# EAGLE design Sonar_Power_Schematic_LT1962_5_33 (EAGLE 8.4.0)
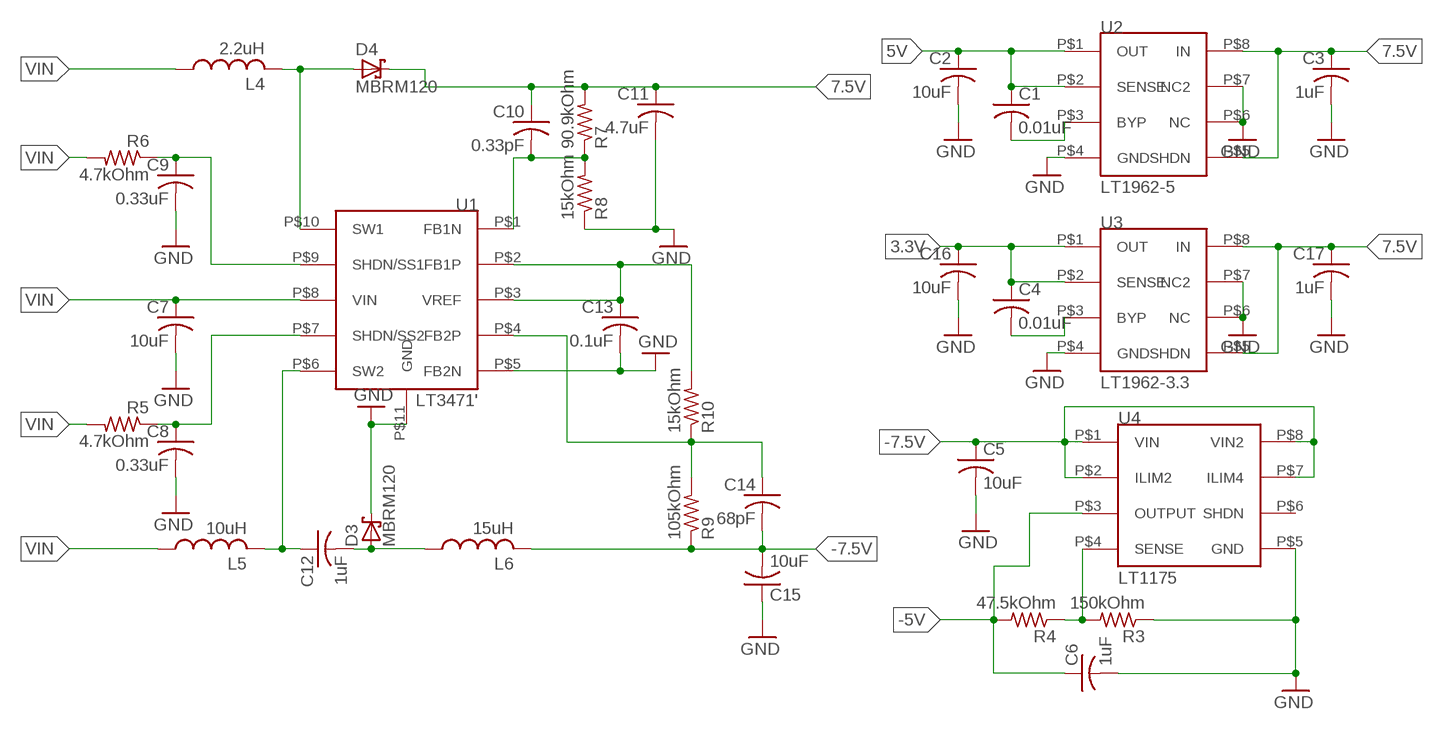
[diagram p0: schematic, sheet 1]

## Parts
C1  0.01uF  C-USC0603  [C0603]
C2  10uF  C-USC0603  [C0603]
C3  1uF  C-USC0603  [C0603]
C4  0.01uF  C-USC0603  [C0603]
C5  10uF  C-USC0603  [C0603]
C6  1uF  C-USC0603  [C0603]
C7  10uF  C-USC0603  [C0603]
C8  0.33uF  C-USC0603  [C0603]
C9  0.33uF  C-USC0603  [C0603]
C10  0.33pF  C-USC0603  [C0603]
C11  4.7uF  C-USC0603  [C0603]
C12  1uF  C-USC0603  [C0603]
C13  0.1uF  C-USC0603  [C0603]
C14  68pF  C-USC0603  [C0603]
C15  10uF  C-USC0603  [C0603]
C16  10uF  C-USC0603  [C0603]
C17  1uF  C-USC0603  [C0603]
D3  MBRM120  [DO-216AA]
D4  MBRM120  [DO-216AA]
L4  2.2uH  LQH5BPN2R2N38L  [NS4.9X4.9]
L5  10uH  VLS5045EX-100M2  [NS5X5]
L6  15uH  VLS5045EX-150M-CA1  [NS5X5]
R3  150kOhm  R-US_R0603  [R0603]
R4  47.5kOhm  R-US_R0603  [R0603]
R5  4.7kOhm  R-US_R0603  [R0603]
R6  4.7kOhm  R-US_R0603  [R0603]
R7  90.9kOhm  R-US_R0603  [R0603]
R8  15kOhm  R-US_R0603  [R0603]
R9  105kOhm  R-US_R0603  [R0603]
R10  15kOhm  R-US_R0603  [R0603]
U1  LT3471'  [10-WFDFN]
U2  LT1962-5  [8-MSOP]
U3  LT1962-3.3  [8-MSOP]
U4  LT1175  [8-SOIC]

## Nets
3.3V: C4.1 C16.1 U3.P$1(OUT) U3.P$2(SENSE)
5V: C1.1 C2.1 U2.P$1(OUT) U2.P$2(SENSE)
7.5V: C3.1 C10.1 C11.1 C17.1 D4.P$1(C) R7.2 U2.P$5(SHDN) U2.P$8(IN) U3.P$5(SHDN) U3.P$8(IN)
-5V: C6.1 R4.2 U4.P$3(OUTPUT)
-7.5V: C5.1 C14.2 C15.2 L6.P$2 R9.1 U4.P$1(VIN) U4.P$2(ILIM2) U4.P$7(ILIM4) U4.P$8(VIN2)
GND: C2.2 C3.2 C5.2 C6.2 C7.2 C8.2 C9.2 C11.2 C13.2 C15.1 C16.2 C17.2 D3.P$1(C) R3.1 R8.1 U1.P$5(FB2N) U1.P$11(GND) U2.P$4(GND) U2.P$6(NC) U2.P$7(NC2) U3.P$4(GND) U3.P$6(NC) U3.P$7(NC2) U4.P$5(GND)
N$1: C4.2 U3.P$3(BYP)
N$4: C1.2 U2.P$3(BYP)
N$9: R3.2 R4.1 U4.P$4(SENSE)
N$17: D4.P$2(A) L4.P$2 U1.P$10(SW1)
N$18: C10.2 R7.1 R8.2 U1.P$1(FB1N)
N$20: C12.1 L5.P$2 U1.P$6(SW2)
N$21: C12.2 D3.P$2(A) L6.P$1
N$26: C14.1 R9.2 R10.1 U1.P$4(FB2P)
SS1: C9.1 R6.1 U1.P$9(SHDN/SS1)
SS2: C8.1 R5.1 U1.P$7(SHDN/SS2)
VIN: C7.1 L4.P$1 L5.P$1 R5.2 R6.2 U1.P$8(VIN)
VREF: C13.1 R10.2 U1.P$2(FB1P) U1.P$3(VREF)
Unconnected: U4.P$6(SHDN)

## Library data of the parts
C1-C17 = adafruit:C-US: CAPACITOR, American symbol
D3 D4 = Moira:MBRM120
L4 = Moira:LQH5BPN2R2N38L: 2.2uH
L5 = Moira:VLS5045EX-100M: VLS5045EX-100M, TDK 10uH, 445-174843-1-ND
L6 = Moira:VLS5045EX-150M-CA: VLS5045EX-150M-CA, TDK 15uH, 445-175141-1-ND
R3-R10 = adafruit:R-US_: RESISTOR, American symbol
U1 = Moira:LT3471: LT3471EDD#TRPBF
U2 = Moira:LT1962-5
U3 = Moira:LT1962-3.3
U4 = Moira:LT1175: LT1175IS8#PBF

## Board
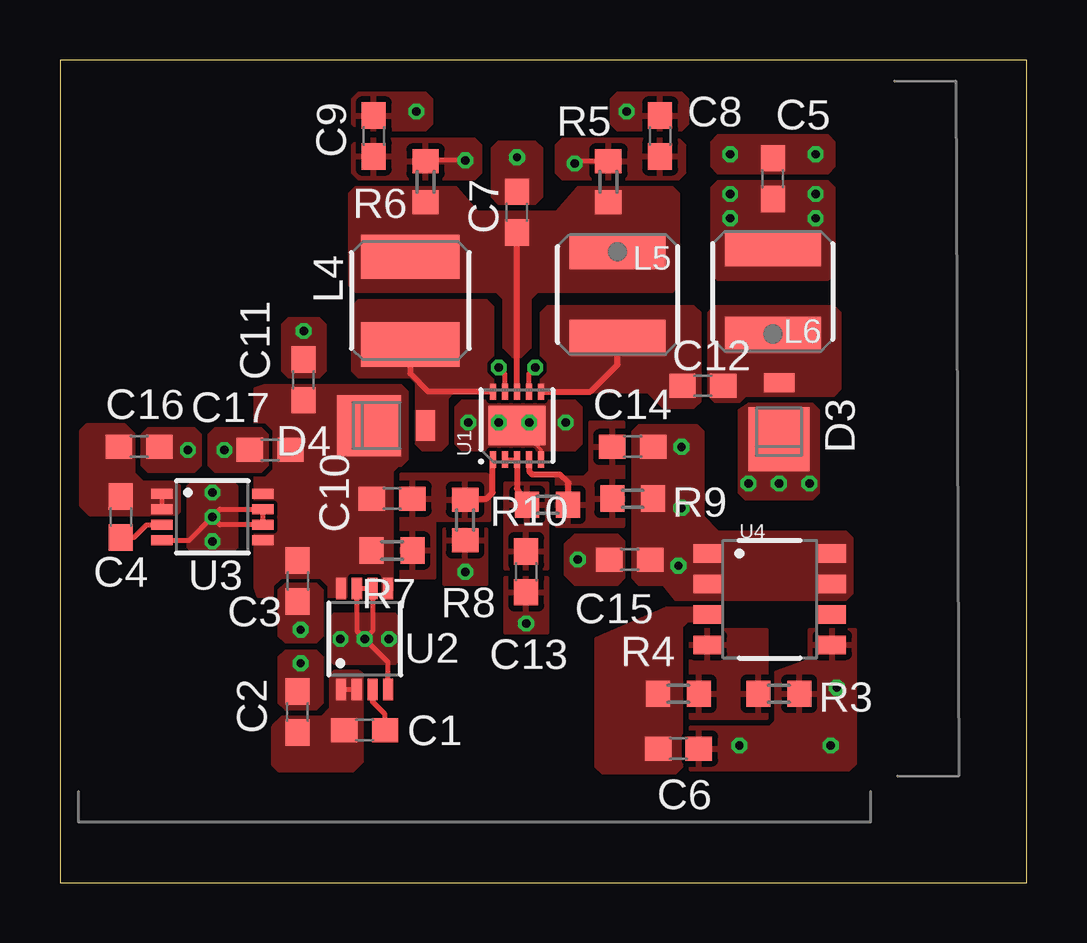
[diagram p1: board, top side]
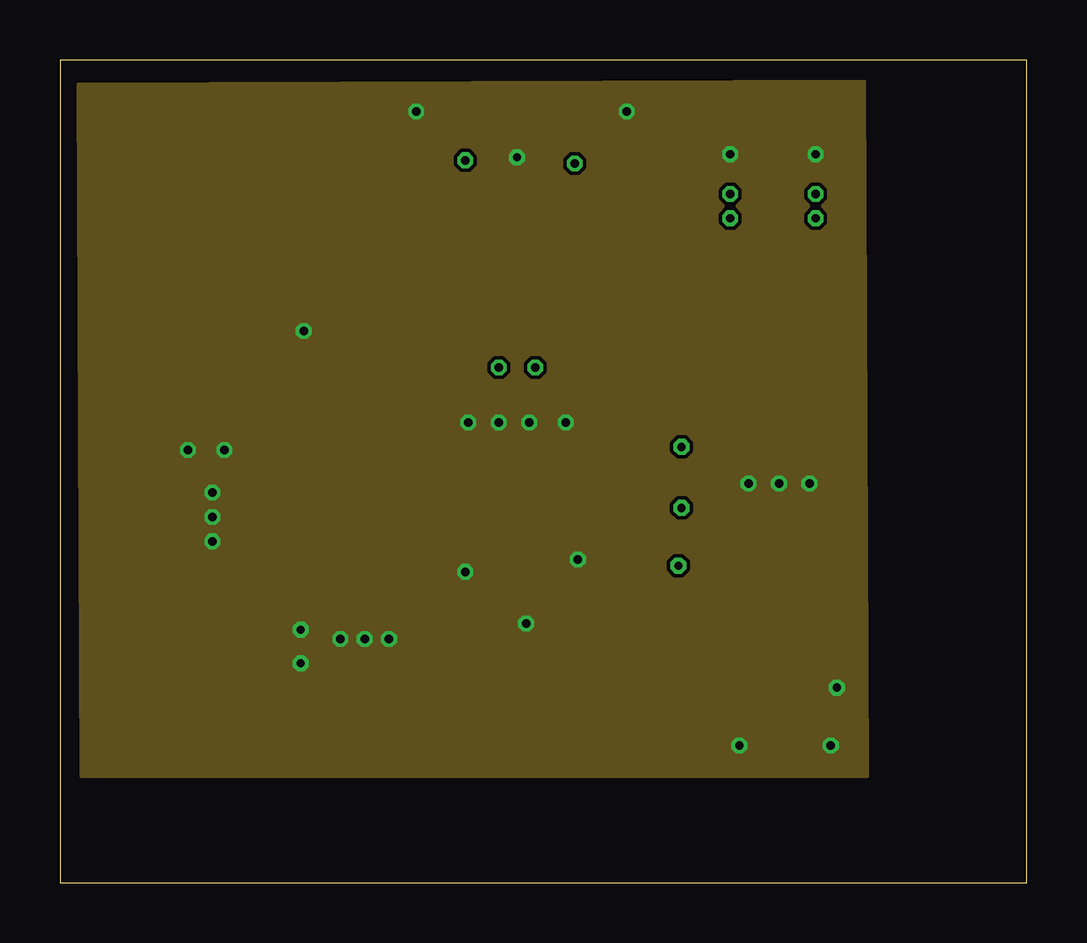
[diagram p2: board, inner layer Route2]
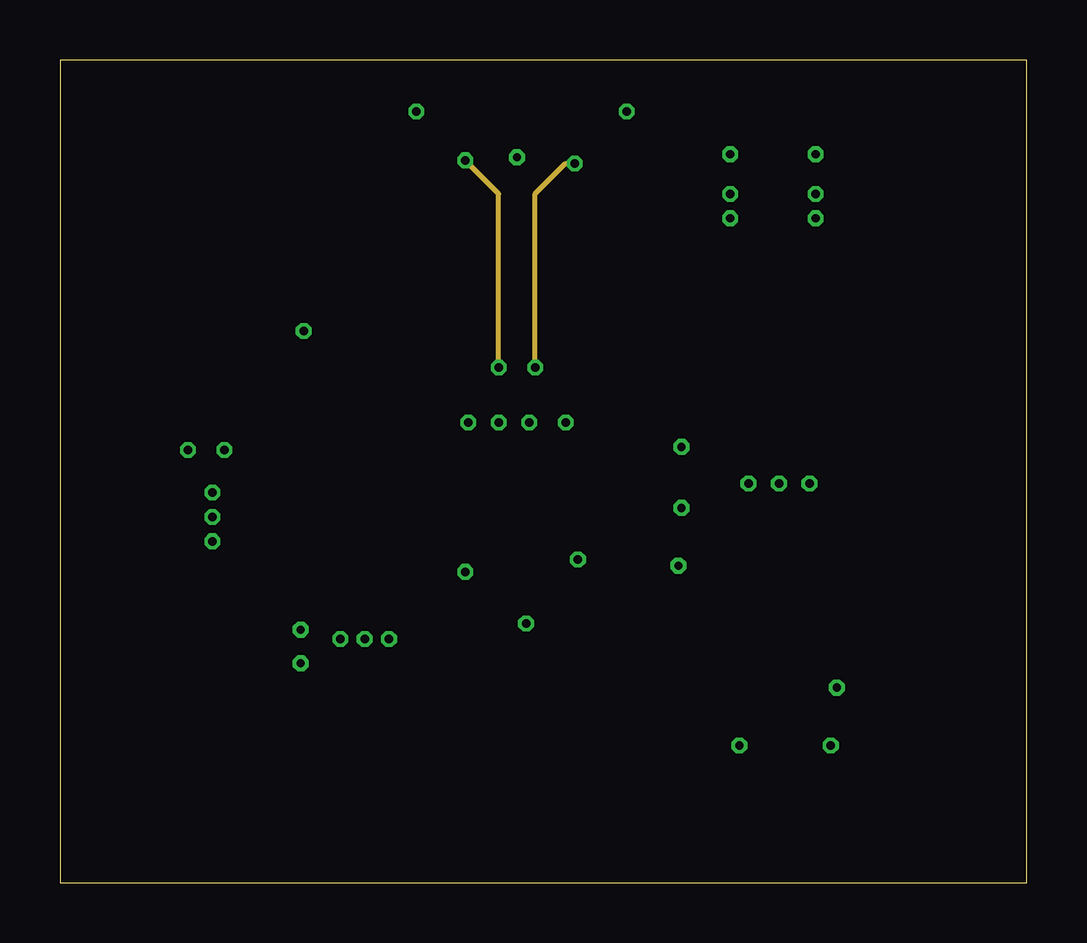
[diagram p3: board, inner layer Route15]
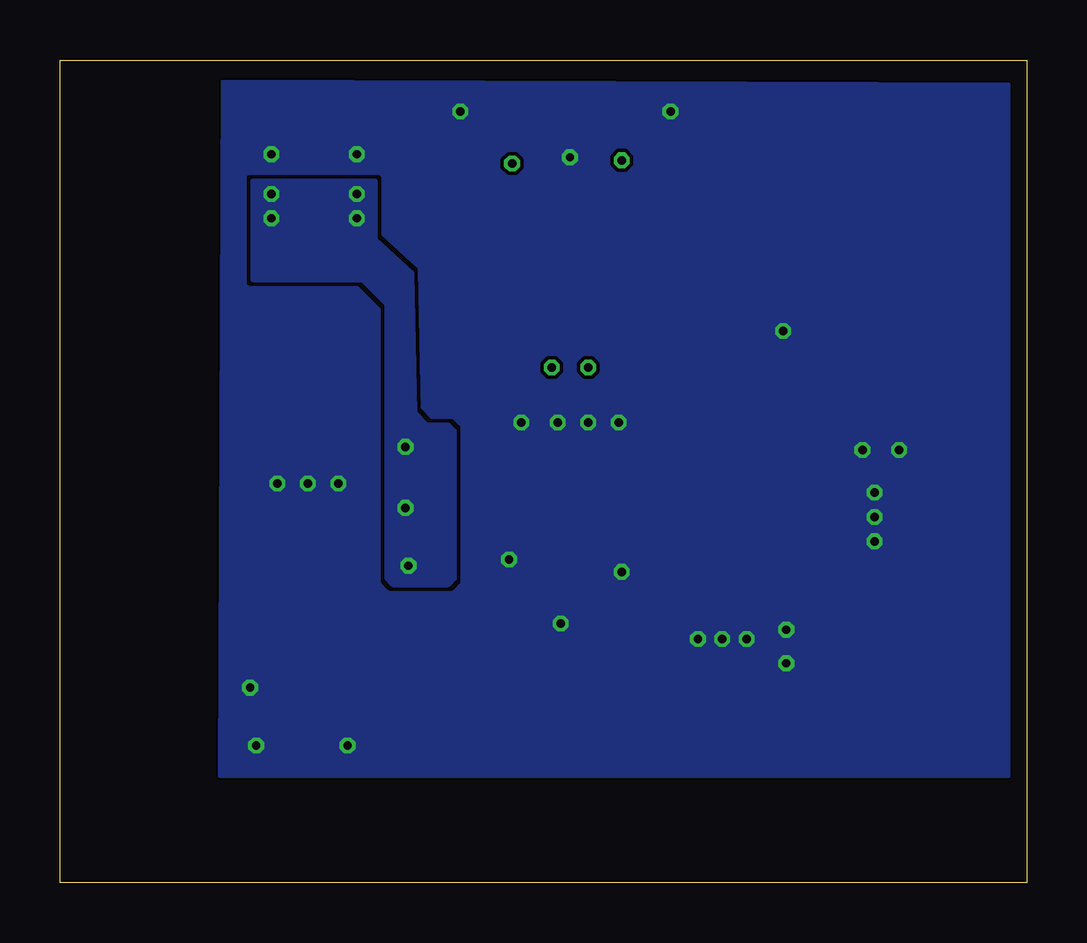
[diagram p4: board, bottom side, seen from below]

Size 40.31 x 34.28 mm. Coordinates in mm from the lower left corner, seen from the top.
Outline: 0,0 40.31,0 40.31,34.28 0,34.28 0,0
Copper layers (1*2*15*16): Top 0.035mm / dielectric 0.1702mm / Route2 0.0175mm / dielectric 47mil / Route15 0.0175mm / dielectric 0.1702mm / Bottom 0.035mm
Design rules "JLCPCB4Layer": minimum track width 6mil, minimum drill 10mil, track to track 6mil, track to pad 6mil, pad to pad 6mil, via to via 6mil, smd to smd 0mil, copper to edge 10mil, drill to drill 10mil, minimum pad ring 6mil, minimum via ring 6mil, stop-mask expansion 2mil, vias tented up to drill 100mil, thermal gap 10mil

### Footprints (pad centres in the part's own frame; a part is rotated, then mirrored left to right if it is on the bottom)
C0603 = smd 1.1 x 1: 1 -0.85,0; 2 0.85,0
DO-216AA = smd 2.67 x 2.54: P$1 -0.699,0 | smd 0.8 x 1.27: P$2 1.653,0
NS4.9X4.9 = smd 1.85 x 4.1: P$1 -1.825,0; P$2 1.825,0
NS5X5 = smd 1.5 x 4: P$1 -1.8,0; P$2 1.8,0
R0603 = smd 1 x 1.1: 1 -0.85,0; 2 0.85,0
10-WFDFN = smd 0.675 x 0.25: P$1 -1.413,1; P$2 -1.413,0.5; P$3 -1.413,0; P$4 -1.413,-0.5; P$5 -1.413,-1; P$6 1.413,-1; P$7 1.413,-0.5; P$8 1.413,0; P$9 1.413,0.5; P$10 1.413,1 | smd 1.65 x 2.38: P$11 0,0
8-MSOP = smd 0.42 x 0.889: P$1 -0.975,-2.106; P$2 -0.325,-2.106; P$3 0.325,-2.106; P$4 0.975,-2.106; P$5 -0.975,2.106; P$6 -0.325,2.106; P$7 0.325,2.106; P$8 0.975,2.106
8-SOIC = smd 1.143 x 0.762: P$1 -2.603,1.905; P$2 -2.603,0.635; P$3 -2.603,-0.635; P$4 -2.603,-1.905; P$5 2.603,-1.905; P$6 2.603,-0.635; P$7 2.603,0.635; P$8 2.603,1.905

### Placement (x,y rotation side)
C1  12.7,6.35 0 top
C2  9.91,7.11 90 top
C3  9.91,12.57 270 top
C4  2.54,15.24 270 top
C5  29.72,29.34 90 top
C6  25.78,5.59 0 top
C7  19.05,27.94 90 top
C8  25.02,31.12 90 top
C9  13.08,31.12 90 top
C10  13.84,16 0 top
C11  10.16,20.96 90 top
C12  26.8,20.7 0 top
C13  19.43,12.95 270 top
C14  23.88,18.16 0 top
C15  23.75,13.46 0 top
C16  3.3,18.16 0 top
C17  8.76,18.03 180 top
D3  29.97,19.18 90 top
D4  13.59,19.05 0 top
L4  14.61,24.26 270 top
L5  23.24,24.51 270 top
L6  29.72,24.64 90 top
R3  29.97,7.87 180 top
R4  25.78,7.87 180 top
R5  22.86,29.21 270 top
R6  15.24,29.21 270 top
R7  13.84,13.84 180 top
R8  16.89,15.11 90 top
R9  23.88,16 180 top
R10  20.32,15.75 180 top
U1  19.05,19.05 90 top
U2  12.7,10.16 0 top
U3  6.35,15.24 270 top
U4  29.59,11.81 0 top

### Tracks (layer width: path | path; a pad name or v marks a point on that pad's centre or on a via)
3.3V
  Top 0.203: U3.P$1 U3.P$2
  pour Top (no thermals): 2.67,19.05 1.14,19.05 0.89,18.8 0.89,15.75 1.27,15.37 4.83,15.37 4.95,15.49 4.95,16.51 4.7,16.64 3.43,16.64 3.05,17.02 3.05,18.67
5V
  Top 0.203: U2.P$1 U2.P$2
  pour Top (no thermals): 8.89,6.48 8.89,4.95 9.14,4.7 12.19,4.7 12.57,5.08 12.57,8.64 12.45,8.76 11.43,8.76 11.3,8.51 11.3,7.24 10.92,6.86 9.27,6.86
7.5V
  pour Top (rank 2, no thermals): 14.22,20.7 8.51,20.7 8.13,20.57 8.13,12.32 8.26,11.94 13.59,11.94 13.84,12.19 13.84,17.14 14.1,17.4 14.22,17.4 14.48,17.65 14.48,20.45
-5V
  pour Top (no thermals): 27.56,11.43 25.27,11.43 22.35,10.16 22.35,4.83 22.61,4.57 25.65,4.57 25.91,4.83 25.91,10.67 26.16,10.92 27.56,10.92
-7.5V  (via drill 0.35)
  other vias: 25.91,18.16 27.94,28.7 31.5,28.7 25.78,13.21 25.91,15.62 27.94,27.69 31.5,27.69
  pour Top (no thermals): 25.78,14.61 25.78,11.81 32.77,11.81 33.02,12.07 33.02,14.35 32.77,14.61
  pour Top (no thermals): 27.18,28.96 27.18,25.4 27.43,25.15 32,25.15 32.26,25.4 32.26,28.96 32,29.21 27.43,29.21
  pour Top (no thermals): 23.88,18.8 23.88,12.7 24.13,12.45 25.15,12.45 25.65,11.81 27.43,11.81 27.43,14.61 26.8,15.24 26.8,18.8 26.54,19.05 24.13,19.05
  pour Bottom (no thermals): 27.18,26.8 27.18,29.21 32.26,29.21 32.26,25.15 27.69,25.15 26.67,24.13 26.67,12.7 26.42,12.45 24.13,12.45 23.88,12.7 23.88,18.8 24.13,19.05 25.02,19.05 25.53,19.56 25.65,25.4
GND  (via drill 0.35)
  Top 0.152: U1.P$5 20.05,18.05 U1.P$11
  Top 0.203: U2.P$4 13.68,9.19 v12.7,10.16 | v12.7,10.16 12.38,10.49 U2.P$6 U2.P$7 13.03,10.49 v12.7,10.16 | U3.P$4 5.38,14.27 v6.35,15.24 | v6.35,15.24 6.68,15.57 U3.P$6 U3.P$7 6.68,14.92 v6.35,15.24
  other vias: 21.59,13.46 19.05,30.23 17.02,19.18 21.08,19.18 16.89,12.95 14.86,32.13 19.43,10.8 23.62,32.13 27.94,30.35 31.5,30.35 10.16,22.99 29.97,16.64 18.29,19.18 19.56,19.18 28.7,16.64 31.24,16.64 11.68,10.16 13.72,10.16 6.35,16.26 6.35,14.22 10.03,9.14 10.03,10.54 5.33,18.03 6.86,18.03 32.39,8.13 32.13,5.72 28.32,5.72
  pour Top (no thermals): 18.29,30.86 18.03,30.61 18.03,28.58 18.29,28.32 19.81,28.32 20.07,28.58 20.07,30.61 19.81,30.86
  pour Top (no thermals): 23.5,12.7 23.5,14.22 23.24,14.48 21.46,14.48 21.08,14.1 21.08,12.83 21.46,12.45 23.24,12.45
  pour Route2: 0.76,33.27 33.53,33.4 33.66,4.45 0.89,4.45
  pour Top (no thermals): 16.51,19.81 16.51,18.29 16.76,18.03 21.46,18.03 21.72,18.29 21.72,19.81 21.46,20.07 16.76,20.07
  pour Top: 16,14.73 17.78,14.73 17.78,12.45 16,12.45
  pour Top: 12.19,32.64 12.19,31.62 12.45,31.37 15.24,31.37 15.49,31.62 15.49,32.64 15.24,32.89 12.45,32.89
  pour Top: 18.54,12.7 18.54,10.41 20.32,10.41 20.32,12.7
  pour Bottom (rank 2): 0.76,33.27 0.76,4.45 33.66,4.45 33.53,33.4
  pour Top: 23.24,32.89 22.99,32.64 22.99,31.62 23.24,31.37 25.91,31.37 26.16,31.62 26.16,32.64 25.91,32.89
  pour Top (no thermals): 32.26,29.84 32.26,30.86 32,31.12 27.43,31.12 27.18,30.86 27.18,29.84 27.43,29.59 32,29.59
  pour Top (no thermals): 9.53,23.5 10.79,23.5 11.05,23.24 11.05,21.34 10.79,21.08 9.53,21.08 9.27,21.34 9.27,23.24
  pour Top (no thermals): 28.32,19.69 28.7,19.94 31.37,19.94 31.62,19.69 31.62,16.26 31.37,16 28.58,16 28.32,16.26
  pour Top (no thermals): 14.22,9.4 14.22,10.92 13.97,11.18 11.43,11.18 11.18,10.92 11.18,9.4 11.43,9.14 13.97,9.14
  pour Top (no thermals): 5.59,13.72 7.11,13.72 7.37,13.97 7.37,16.51 7.11,16.76 5.59,16.76 5.33,16.51 5.33,13.97
  pour Top (no thermals): 10.67,7.24 9.4,7.24 9.14,7.49 9.14,9.4 9.4,9.65 10.67,9.65 10.92,9.4 10.92,7.49
  pour Top (no thermals): 10.67,10.03 9.4,10.03 9.14,10.29 9.14,12.19 9.4,12.45 10.67,12.45 10.92,12.19 10.92,10.29
  pour Top (no thermals): 3.43,17.4 3.43,18.67 3.68,18.92 5.59,18.92 5.84,18.67 5.84,17.4 5.59,17.14 3.68,17.14
  pour Top (no thermals): 6.22,17.4 6.22,18.67 6.48,18.92 8.38,18.92 8.64,18.67 8.64,17.4 8.38,17.14 6.48,17.14
  pour Top: 29.59,6.48 29.84,6.73 29.84,8.76 31.24,9.27 31.24,10.54 33.15,10.54 33.15,4.95 32.89,4.7 26.29,4.7 26.29,6.48
N$1
  Top 0.203: C4.2 3.09,14.39 3.61,14.92 U3.P$3
N$4
  Top 0.203: C1.2 13.55,7.02 13.03,7.55 U2.P$3
N$9
  pour Top: 26.29,6.86 29.46,6.86 29.46,10.54 26.29,10.54
N$17
  Top 0.254: U1.P$10 15.35,20.46 14.61,21.21 L4.P$2
  pour Top (no thermals): 18.03,24 18.03,20.7 17.78,20.45 16.38,20.45 16.13,20.19 16.13,18.29 15.88,18.03 15.11,18.03 14.86,18.29 14.86,20.83 14.61,21.08 12.45,21.08 12.19,21.34 12.19,24 12.45,24.26 17.78,24.26
N$18
  Top 0.254: R8.2 16.93,16 17.78,16 18.03,16.26 18.03,17.62 U1.P$1
  pour Top: 14.22,17.02 14.22,12.7 15.62,12.7 15.62,15.11 17.91,15.11 17.91,17.02
N$20
  Top 0.254: U1.P$6 22.11,20.46 23.24,21.59 L5.P$2
  pour Top (no thermals): 26.67,23.75 26.67,20.07 26.42,19.81 25.15,19.81 24.51,20.45 20.32,20.45 20.07,20.7 20.07,23.75 20.32,24 26.42,24
N$21
  pour Top (no thermals): 27.05,23.75 27.05,20.32 27.3,20.07 28.32,20.07 28.58,20.32 32.26,20.32 32.51,20.57 32.51,23.75 32.26,24 27.3,24
N$26
  Top 0.254: U1.P$4 19.56,17.14 19.69,17.02 20.83,17.02 21.21,16.64 21.17,16.6 R10.1
  pour Top: 20.7,16.89 20.7,14.86 23.5,14.86 23.5,19.18 22.1,19.18 22.1,17.14 21.84,16.89
SS1  (via drill 0.35)
  Top 0.203: U1.P$9 18.55,21.2 v18.29,21.46 | v16.89,30.1 15.28,30.1 R6.1
  Route15 0.203: v18.29,21.46 18.29,28.7 v16.89,30.1
  pour Top: 12.45,30.99 12.19,30.73 12.19,29.59 12.45,29.34 17.27,29.34 17.53,29.59 17.53,30.73 17.27,30.99
SS2  (via drill 0.35)
  Top 0.203: U1.P$7 19.55,21.2 v19.81,21.46 | R5.1 21.55,30.06 v21.46,29.97
  Route15 0.203: v19.81,21.46 19.81,28.7 21.08,29.97 v21.46,29.97
  pour Top: 20.7,30.73 20.7,29.59 20.96,29.34 25.78,29.34 26.04,29.59 26.04,30.73 25.78,30.99 20.96,30.99
VIN
  Top 0.254: U1.P$8 C7.1
  pour Top (no thermals): 12.07,28.7 12.07,24.89 12.32,24.64 25.53,24.64 25.78,25.02 25.78,28.7 25.53,28.96 21.59,28.96 20.7,27.94 17.4,27.94 16.51,28.96 12.32,28.96
  pour Top: 18.54,24.38 18.54,22.35 18.92,21.97 19.18,21.97 19.56,22.35 19.56,24.38 19.94,24.77 19.94,27.69 18.29,27.69 18.16,27.56 18.16,24.77
VREF
  Top 0.152: U1.P$2 U1.P$3
  Top 0.254: U1.P$3 19.05,16.42 R10.2
  pour Top: 18.54,16.64 18.54,13.08 20.32,13.08 20.32,16.64